# Altium project IR_WirelessV1.0.PrjPCB
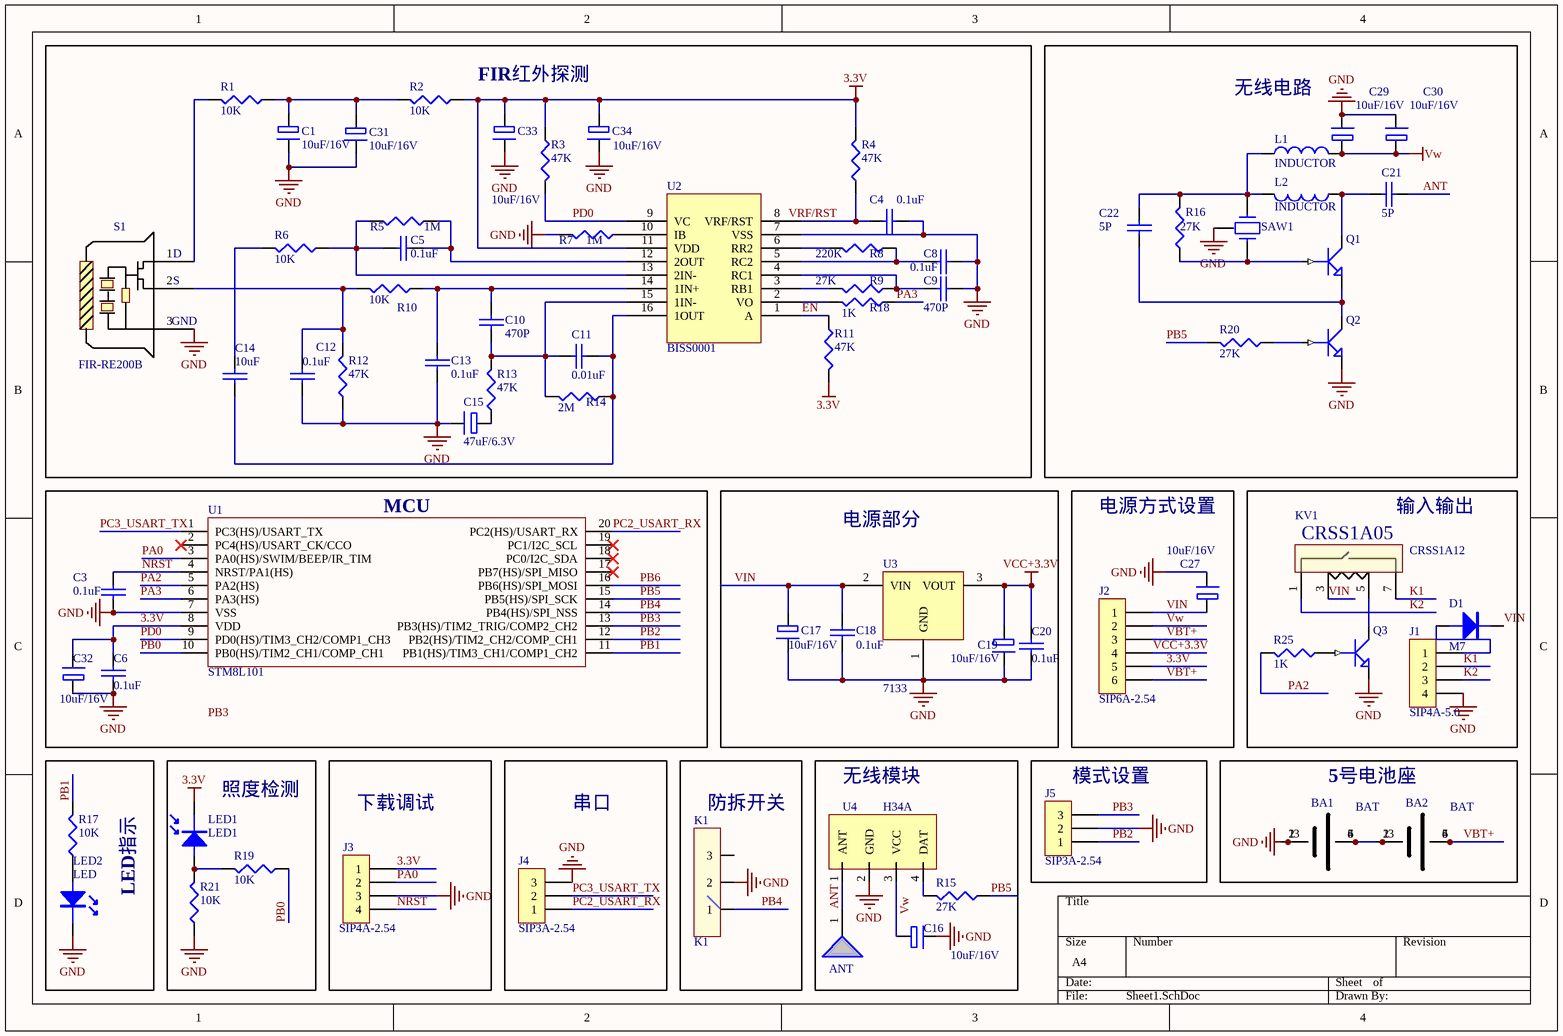
[diagram p0: Sheet1.SchDoc]
2 sheets, 85 parts. Net scope: global (net labels, ports and power ports of the same name join across sheets).
Board file: PCB1.PcbDoc
Sheets:
  Sheet1.SchDoc
  Sheet2.SchDoc

## Sheet Sheet1.SchDoc
size A4

### Parts
(Parts that share a designator on the sheet are numbered #1, #2 ... from top to bottom, then left to right.)
ANT  ANT  [ANT1]  (value not drawn)
BA1  BAT  [BAT-5]
BA2  BAT  [BAT-5]
C1  10uF/16V  [0805]
C3  0.1uF  [0603]
C4  0.1uF  [0603]
C5  0.1uF  [0603]
C6  0.1uF  [0603]
C8  0.1uF  [0603]
C9  470P  [0603]
C10  470P  [0603]
C11  0.01uF  [0603]
C12  0.1uF  [0603]
C13  0.1uF  [0603]
C14  10uF  [0805]
C15  47uF/6.3V  [A-3216]
C16  10uF/16V  [0805]
C17  10uF/16V  [0805]
C18  0.1uF  [0603]
C19  10uF/16V  [0805]
C20  0.1uF  [0603]
C21#1  5P  [0603]
C22#1  5P  [0603]
C27  10uF/16V  [0805]
C29#1  10uF/16V  [0805]
C30  10uF/16V  [0805]
C31  10uF/16V  [0805]
C32  10uF/16V  [0805]
C33  10uF/16V  [0805]
C34  10uF/16V  [0805]
D1  M7  [SMB]
J1  SIP4A-5.0  [5.0-4]
J2  SIP6A-2.54  [2.54*3*2]
J3  SIP4A-2.54  [2.54-4px]
J4  SIP3A-2.54  [2.54-TX]
J5  SIP3A-2.54  [2.54-TX]
K1  K1  [SS-5GL]
KV1  CRSS1A12  [CRSS1A]
L1#1  INDUCTOR  [4.5t]
L2#1  INDUCTOR  [4.5T]
LED1  LED1  [LED-5]
LED2  LED  [LED-0805]
Q1#1  NPN1  [SOT-23]  (value not drawn)
Q2#1  NPN1  [SOT-23]  (value not drawn)
Q3  NPN1  [SOT-23]  (value not drawn)
R1  10K  [0603]
R2  10K  [0603]
R3  47K  [0603]
R4  47K  [0603]
R5  1M  [0603]
R6  10K  [0603]
R7  1M  [0603]
R8  220K  [0603]
R9  27K  [0603]
R10  10K  [0603]
R11  47K  [0603]
R12  47K  [0603]
R13  47K  [0603]
R14  2M  [0603]
R15  27K  [0603]
R16#1  27K  [0603]
R17  10K  [0603]
R18  1K  [0603]
R19  10K  [0603]
R20#1  27K  [0603]
R21  10K  [0603]
R25  1K  [0603]
S1  FIR-RE200B  [TO-39]
SAW1#1  (no value)  [TO-39]
U1  STM8L101  [TSSOP20]
U2  BISS0001  [SOP16]
U3  7133  [SOT-89]
U4  H34A  [H34]

### Blocks framed on the sheet
FIR红外探测: C1 C4 C5 C8-C15 C31 C33 C34 R1-R14 R18 S1 U2
无线电路: C21#1 C22#1 C29#1 C30 L1#1 L2#1 Q1#1 Q2#1 R16#1 R20#1 SAW1#1
MCU: C3 C6 C32 U1
电源部分: C17-C20 U3
电源方式设置: C27 J2
输入输出: D1 J1 KV1 Q3 R25
LED指示: LED2 R17
照度检测: LED1 R19 R21
下载调试: J3
串口: J4
防拆开关: K1
无线模块: ANT C16 R15 U4
模式设置: J5
5号电池座: BA1 BA2

### Nets
3.3V: C6.1 C32.2 C33.1 C34.1 J2.5 J3.1 LED1.2 R2.1 R3.1 R4.2 R11.2 U1.8(VDD) U2.11(VDD)
GND: BA1.1 BA1.2 C1.2 C3.2 C4.2 C6.2 C8.2 C9.2 C12.2 C13.2 C15.2 C16.2 C17.2 C18.2 C19.2 C20.2 C27.2 C29#1.2 C30.2 C31.2 C32.1 C33.2 C34.2 J1.4 J3.3 J4.3 J5.2 K1.2 LED2.2 Q2#1.2(E) Q3.2(E) R7.2 R12.1 R21.1 S1.3 SAW1#1.3(GND) U1.7(VSS) U2.7(VSS) U3.1(GND) U4.2(GND)
VCC+3.3V: C19.1 C20.1 J2.4 U3.3(VOUT)
Vw: C16.1 C29#1.1 C30.1 J2.2 L1#1.2 U4.3(VCC)
ANT: ANT.1 C21#1.2 U4.1(ANT)
EN: R11.1 U2.1(A)
K1: J1.2 KV1.7
K2: J1.3 KV1.1
NRST: C3.1 J3.4 U1.4(NRST/PA1(HS))
PA0: J3.2 U1.3(PA0(HS)/SWIM/BEEP/IR_TIM)
PA2: R25.2 U1.5(PA2(HS))
PA3: R18.1 U1.6(PA3(HS))
PB0: R19.1 U1.10(PB0(HS)/TIM2_CH1/COMP_CH1)
PB1: R17.2 U1.11(PB1(HS)/TIM3_CH1/COMP1_CH2)
PB2: J5.1 U1.12(PB2(HS)/TIM2_CH2/COMP_CH1)
PB3: J5.3 U1.13(PB3(HS)/TIM2_TRIG/COMP2_CH2)
PB4: K1.1 U1.14(PB4(HS)/SPI_NSS)
PB5: R15.1 R20#1.2 U1.15(PB5(HS)/SPI_SCK)
PB6: U1.16(PB6(HS)/SPI_MOSI)
PC2_USART_RX: J4.1 U1.20(PC2(HS)/USART_RX)
PC3_USART_TX: J4.2 U1.1(PC3(HS)/USART_TX)
PD0: R3.2 U1.9(PD0(HS)/TIM3_CH2/COMP1_CH3) U2.9(VC)
VBT+: BA2.4 BA2.5 BA2.6 J2.3 J2.6
VIN: C17.1 C18.1 C27.1 D1.2(K) J2.1 KV1.3 U3.2(VIN)
NetBA1_4: BA1.4 BA1.5 BA1.6 BA2.1 BA2.2
NetC1_1: C1.1 C31.1 R1.1 R2.2
NetC4_1: C4.1 R4.1 U2.8(VRF/RST)
NetC5_1: C5.1 R5.2 R6.1 U2.13(2IN-)
NetC5_2: C5.2 R5.1 U2.12(2OUT)
NetC8_1: C8.1 R8.1 U2.5(RC2)
NetC9_1: C9.1 R9.1 U2.4(RC1)
NetC10_1: C10.1 C13.1 R10.1 U2.14(1IN+)
NetC10_2: C10.2 C11.1 R13.2 R14.2 U2.15(1IN-)
NetC11_2: C11.2 C14.2 R14.1 U2.16(1OUT)
NetC12_1: C12.1 R10.2 R12.2 S1.2
NetC14_1: C14.1 R6.2
NetC15_1: C15.1 R13.1
NetC21#1_1: C21#1.1 L2#1.1 Q1#1.3(C)
NetC22#1_1: C22#1.1 L1#1.1 L2#1.2 R16#1.2 SAW1#1.1
NetC22#1_2: C22#1.2 Q1#1.2(E) Q2#1.3(C)
NetD1_1: D1.1(A) J1.1
NetKV1_5: KV1.5 Q3.3(C)
NetLED1_1: LED1.1 R19.2 R21.2
NetLED2_1: LED2.1 R17.1
NetQ1#1_1: Q1#1.1(B) R16#1.1 SAW1#1.2
NetQ2#1_1: Q2#1.1(B) R20#1.1
NetQ3_1: Q3.1(B) R25.1
NetR1_2: R1.2 S1.1
NetR7_1: R7.1 U2.10(IB)
NetR8_2: R8.2 U2.6(RR2)
NetR9_2: R9.2 U2.3(RB1)
NetR15_2: R15.2 U4.4(DAT)
NetR18_2: R18.2 U2.2(VO)

Not connected (* = marked no-connect by the designer): BA1 3; BA2 3; K1 3; U1 2(PC4(HS)/USART_CK/CCO)* 17(PB7(HS)/SPI_MISO)* 18(PC0/I2C_SDA)* 19(PC1/I2C_SCL)*

### Notes on the sheet
- Labels drawn without touching a wire or pin: PB3, VRF/RST
- (in symbol FIR-RE200B) D; S; GND

### Library data of the parts
C1 C15-C17 C19 C27 C29#1 C30-C34 = C+
C3-C6 C8-C14 C18 C20 C21#1 C22#1 = CAP
D1 = DIODE
J1 J3 = SIP4A-2.50(带槽)
J2 = SIP6A-2.50(带槽)
J4 J5 = SIP3A-2.50（带槽）
KV1 = CRSS1A05
L1#1 L2#1 = INDUCTOR: 4.5T
Q1#1 = NPN1: 2SC3357
Q2#1 = NPN1: 3904
Q3 = NPN1: 8050
R1-R15 R16#1 R17-R19 R20#1 R21 R25 = RES1
SAW1#1 = CRYSTAL(表面接地)

## Sheet Sheet2.SchDoc
size A4
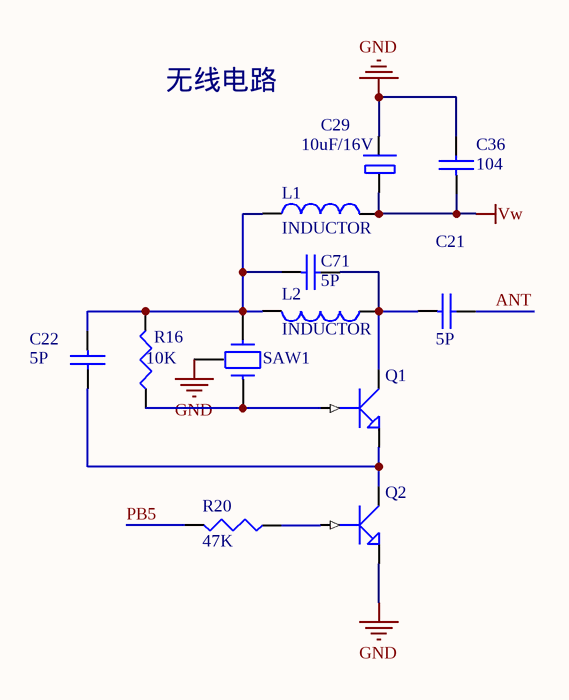
[diagram p1: Sheet2.SchDoc]

### Parts
(Parts that share a designator on the sheet are numbered #1, #2 ... from top to bottom, then left to right.)
C21#2  5P  [0603]
C22#2  5P  [0603]
C29#2  10uF/16V  [0805]
C36  104  [0603]
C71  5P  [0603]
L1#2  INDUCTOR  [4.5t]
L2#2  INDUCTOR  [4.5T]
Q1#2  NPN1  [SOT-23]  (value not drawn)
Q2#2  NPN1  [SOT-23]  (value not drawn)
R16#2  10K  [0603]
R20#2  47K  [0603]
SAW1#2  (no value)  [TO-39]

### Nets
GND: C29#2.2 C36.2 Q2#2.2(E) SAW1#2.3(GND)
Vw: C29#2.1 C36.1 L1#2.2
ANT: C21#2.2
PB5: R20#2.2
NetC21#2_1: C21#2.1 C71.2 L2#2.1 Q1#2.3(C)
NetC22#2_1: C22#2.1 C71.1 L1#2.1 L2#2.2 R16#2.2 SAW1#2.1
NetC22#2_2: C22#2.2 Q1#2.2(E) Q2#2.3(C)
NetQ1#2_1: Q1#2.1(B) R16#2.1 SAW1#2.2
NetQ2#2_1: Q2#2.1(B) R20#2.1

### Notes on the sheet
- 无线电路

### Library data of the parts
C21#2 C22#2 C36 C71 = CAP
C29#2 = C+
L1#2 L2#2 = INDUCTOR: 4.5T
Q1#2 = NPN1: 2SC3357
Q2#2 = NPN1: 3904
R16#2 R20#2 = RES1
SAW1#2 = CRYSTAL(表面接地)

## Nets that join several sheets
GND: Sheet1 (40 pins), Sheet2 (C29#2.2 C36.2 Q2#2.2 SAW1#2.3)
Vw: Sheet1 (6 pins), Sheet2 (C29#2.1 C36.1 L1#2.2)
ANT: Sheet1 (ANT.1 C21#1.2 U4.1), Sheet2 (C21#2.2)
PB5: Sheet1 (R15.1 R20#1.2 U1.15), Sheet2 (R20#2.2)